# Altium project Soldeerbout_V2.PrjPcb
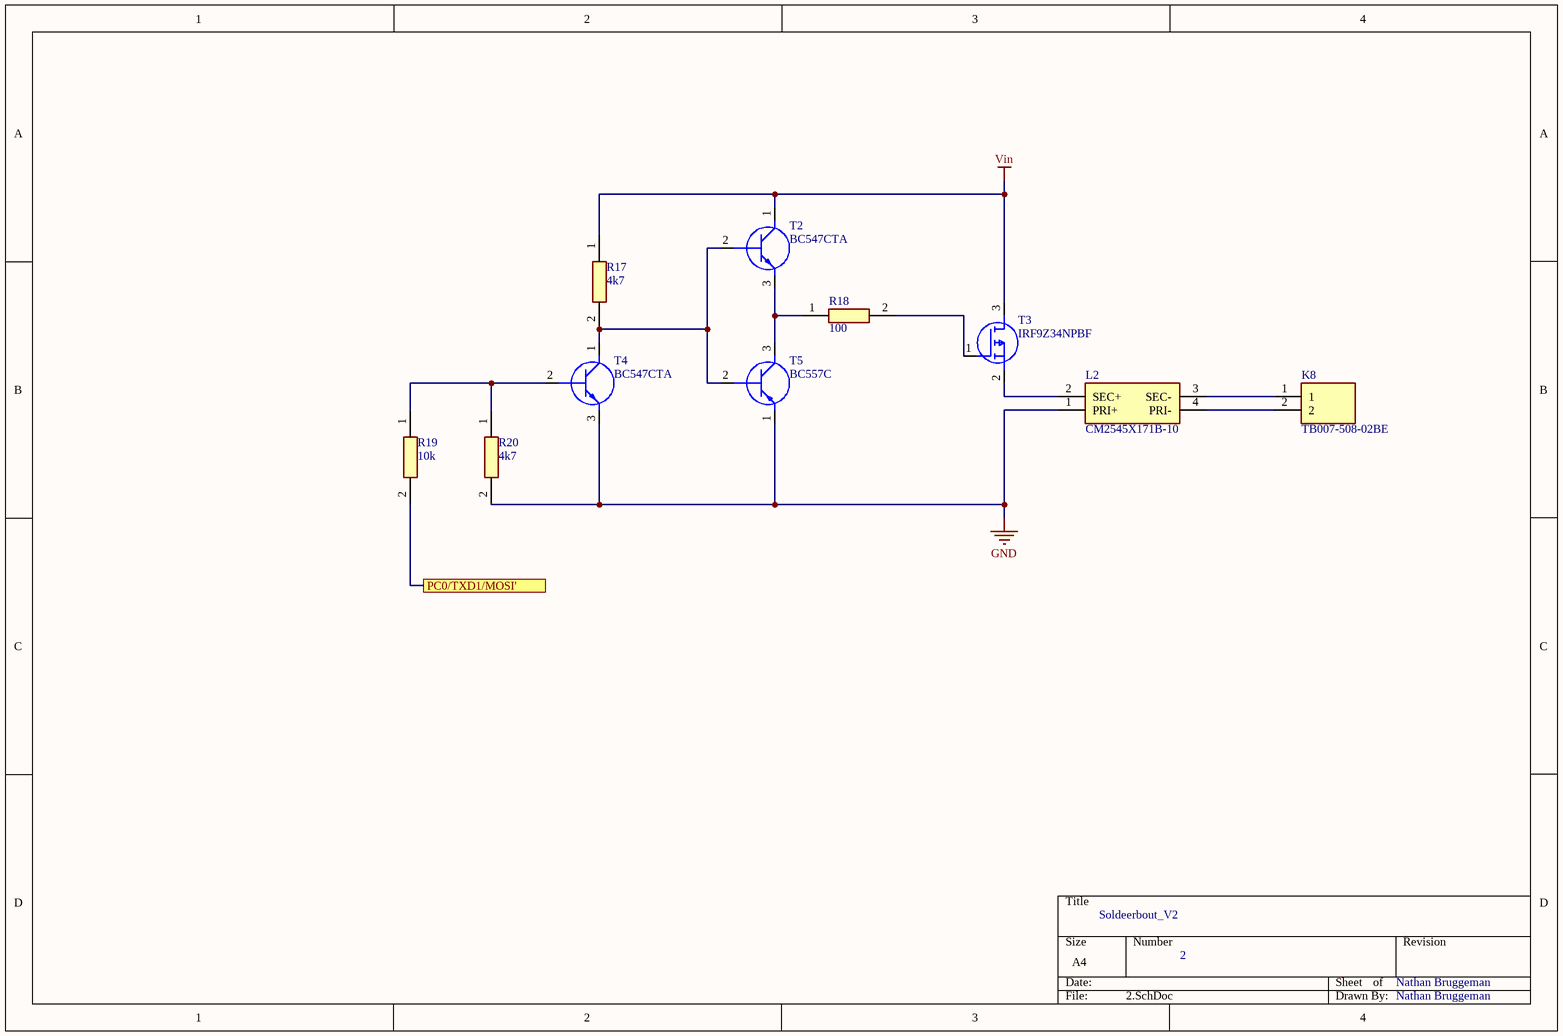
[diagram p0: 2.SchDoc]
2 sheets, 19 parts. Net scope: flat (ports and power ports of the same name join across sheets).
Board file: PCB1.PcbDoc
Sheets:
  2.SchDoc
  6.SchDoc

## Sheet 2.SchDoc
size A4; SheetNumber: 2; SheetTotal: 5

### Parts
K8  TB007-508-02BE  [TB00750802BE]
L2  CM2545X171B-10  [CM2545X171B10]
R17  4k7  [0805]
R18  100  [0805]
R19  10k  [0805]
R20  4k7  [0805]
T2  BC547CTA  [BC557C]
T3  IRF9Z34NPBF  [TO254P469X1042X1967-3P]
T4  BC547CTA  [BC557C]
T5  BC557C  [BC557C]

### Ports
PC0/TXD1/MOSI'

### Nets
GND: L2.1(PRI+) R20.2 T4.3(E) T5.1(E)
Vin: R17.1 T2.1(C) T3.3(D)
NetK8_1: K8.1 L2.3(SEC-)
NetK8_2: K8.2 L2.4(PRI-)
NetL2_2: L2.2(SEC+) T3.2(S)
NetR17_2: R17.2 T2.2(B) T4.1(C) T5.2(B)
NetR18_1: R18.1 T2.3(E) T5.3(C)
NetR18_2: R18.2 T3.1(G)
NetR19_1: R19.1 R20.1 T4.2(B)
NetR19_2: R19.2 ; port PC0/TXD1/MOSI'

### Notes on the sheet
- Soldeerbout_V2
- 2
- Nathan Bruggeman

### Library data of the parts
K8 = TB007-508-02BE: Connector; Manufacturer_Name: CUI Inc.; Datasheet Link: https://componentsearchengine.com//TB007-508-02BE.pdf; Height: 14mm; Mouser2 Part Number: 490-TB007-508-02BE; Mouser2 Price/Stock: https://www.mouser.com/Search/Refine.aspx?Keyword=490-TB007-508-02BE; Manufacturer_Part_Number: TB007-508-02BE
L2 = CM2545X171B-10: Transformer; Manufacturer_Name: Laird Technologies; Datasheet Link: https://datasheet.datasheetarchive.com/originals/dk/DKDS-7/122753.pdf; Height: 9.5mm; Manufacturer_Part_Number: CM2545X171B-10
R17-R20 = CFN0805-FZ-R030ELF: Resistor; Manufacturer_Name: Bourns; Datasheet Link: https://www.bourns.com/docs/Product-Datasheets/CFN.pdf; Height: 0.9mm; Manufacturer_Part_Number: CFN0805-FZ-R030ELF
T2 T4 = BC547CTA: Transistor BJT NPN; Manufacturer_Name: ON Semiconductor; Datasheet Link: http://www.onsemi.com/pub/Collateral/BC550-D.pdf; Manufacturer_Part_Number: BC547CTA
T3 = IRF9Z34NPBF: MOSFET (P-Channel); Manufacturer_Name: Infineon; Datasheet Link: https://componentsearchengine.com//IRF9Z34NPBF.pdf; Height: 4.69mm; Mouser2 Part Number: 942-IRF9Z34NPBF; Mouser2 Price/Stock: https://www.mouser.com/Search/Refine.aspx?Keyword=942-IRF9Z34NPBF; Manufacturer_Part_Number: IRF9Z34NPBF
T5 = BC557C: Transistor BJT PNP; Manufacturer_Name: NXP; Height: 5.2mm; Manufacturer_Part_Number: BC557C

## Sheet 6.SchDoc
size A4; SheetNumber: 5; SheetTotal: 5
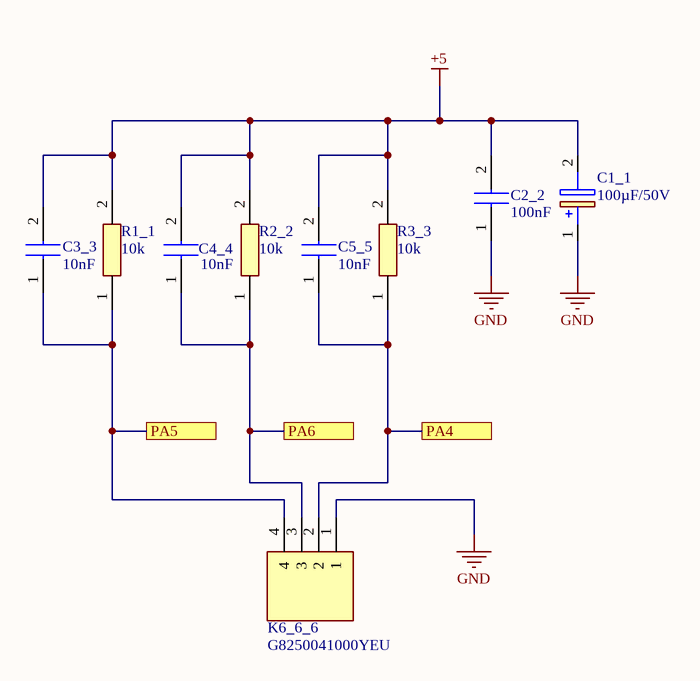
[diagram p1: 6.SchDoc]

### Parts
C1_1  100µF/50V  [CAPPRD350W60D800H1250]
C2_2  100nF  [0805]
C3_3  10nF  [0805]
C4_4  10nF  [0805]
C5_5  10nF  [0805]
K6_6_6  G8250041000YEU  [G8250041000YEU]
R1_1  10k  [0805]
R2_2  10k  [0805]
R3_3  10k  [0805]

### Ports
PA4, PA5, PA6

### Nets
+5: C1_1.2(-) C2_2.2 C3_3.2 C4_4.2 C5_5.2 R1_1.2 R2_2.2 R3_3.2
GND: C1_1.1(+) C2_2.1 K6_6_6.1
NetC3_3_1: C3_3.1 K6_6_6.4 R1_1.1 ; port PA5
NetC4_4_1: C4_4.1 K6_6_6.3 R2_2.1 ; port PA6
NetC5_5_1: C5_5.1 K6_6_6.2 R3_3.1 ; port PA4

### Library data of the parts
C1_1 = ESK107M050AG3EA: Capacitor Polarised; Manufacturer_Name: Kemet; Height: 12.5mm; Manufacturer_Part_Number: ESK107M050AG3EA
C2_2 C3_3 C4_4 C5_5 = C0805C301G5GACTU: Capacitor; Manufacturer_Name: Kemet; Datasheet Link: https://connect.kemet.com:7667/gateway/IntelliData-ComponentDocumentation/1.0/download/specsheet/C0805C301G5GACTU; Height: 0.88mm; Manufacturer_Part_Number: C0805C301G5GACTU
K6_6_6 = G8250041000YEU: Connector; Manufacturer_Name: Amphenol; Datasheet Link: https://cdn.amphenol-icc.com/media/wysiwyg/files/drawing/g825xxx10x0yeu.pdf; Height: 6.35mm; Manufacturer_Part_Number: G8250041000YEU
R1_1 R2_2 R3_3 = CFN0805-FZ-R030ELF: Resistor; Manufacturer_Name: Bourns; Datasheet Link: https://www.bourns.com/docs/Product-Datasheets/CFN.pdf; Height: 0.9mm; Manufacturer_Part_Number: CFN0805-FZ-R030ELF

## Nets that join several sheets
GND: 2 (L2.1 R20.2 T4.3 T5.1), 6 (C1_1.1 C2_2.1 K6_6_6.1)